# EasyEDA Pro project ProPrj_FOC_TEST_2025-02-24.epro, schematic 原理图

## Sheets
1 MUC: Create Date: 2024-08-19; Page Name: MUC; Project Name: FOC_TEST; Schematic Name: 原理图; Update Date: 2024-08-21; Company: 嘉立创EDA; Page Size: A4; Version: V1.0
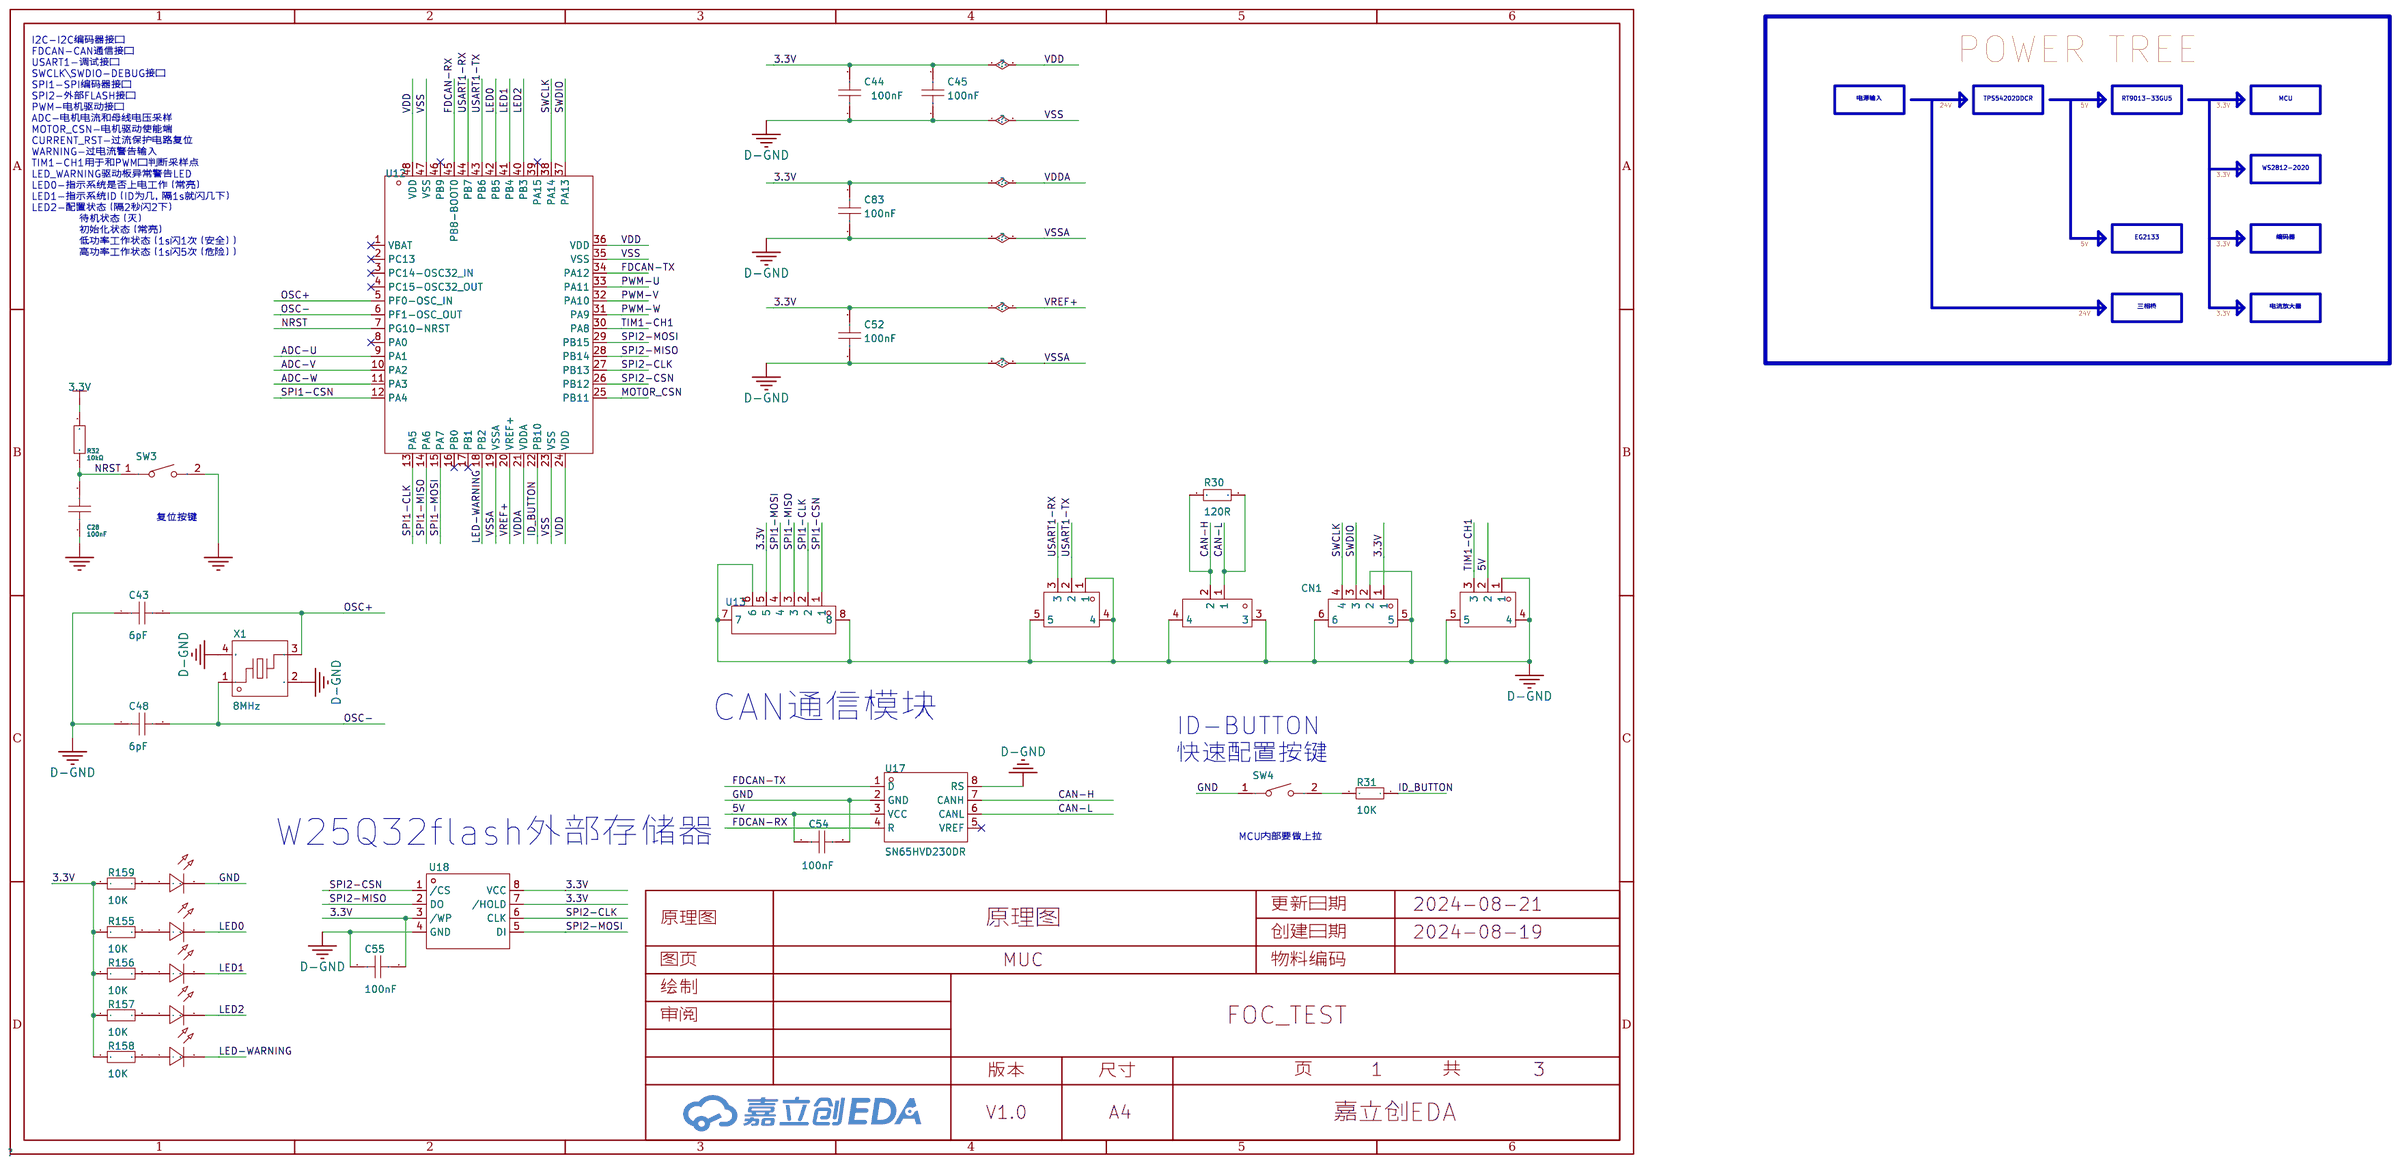
[diagram p0: MUC]
2 电源部分: Board Name: Board1; Page Name: 电源部分
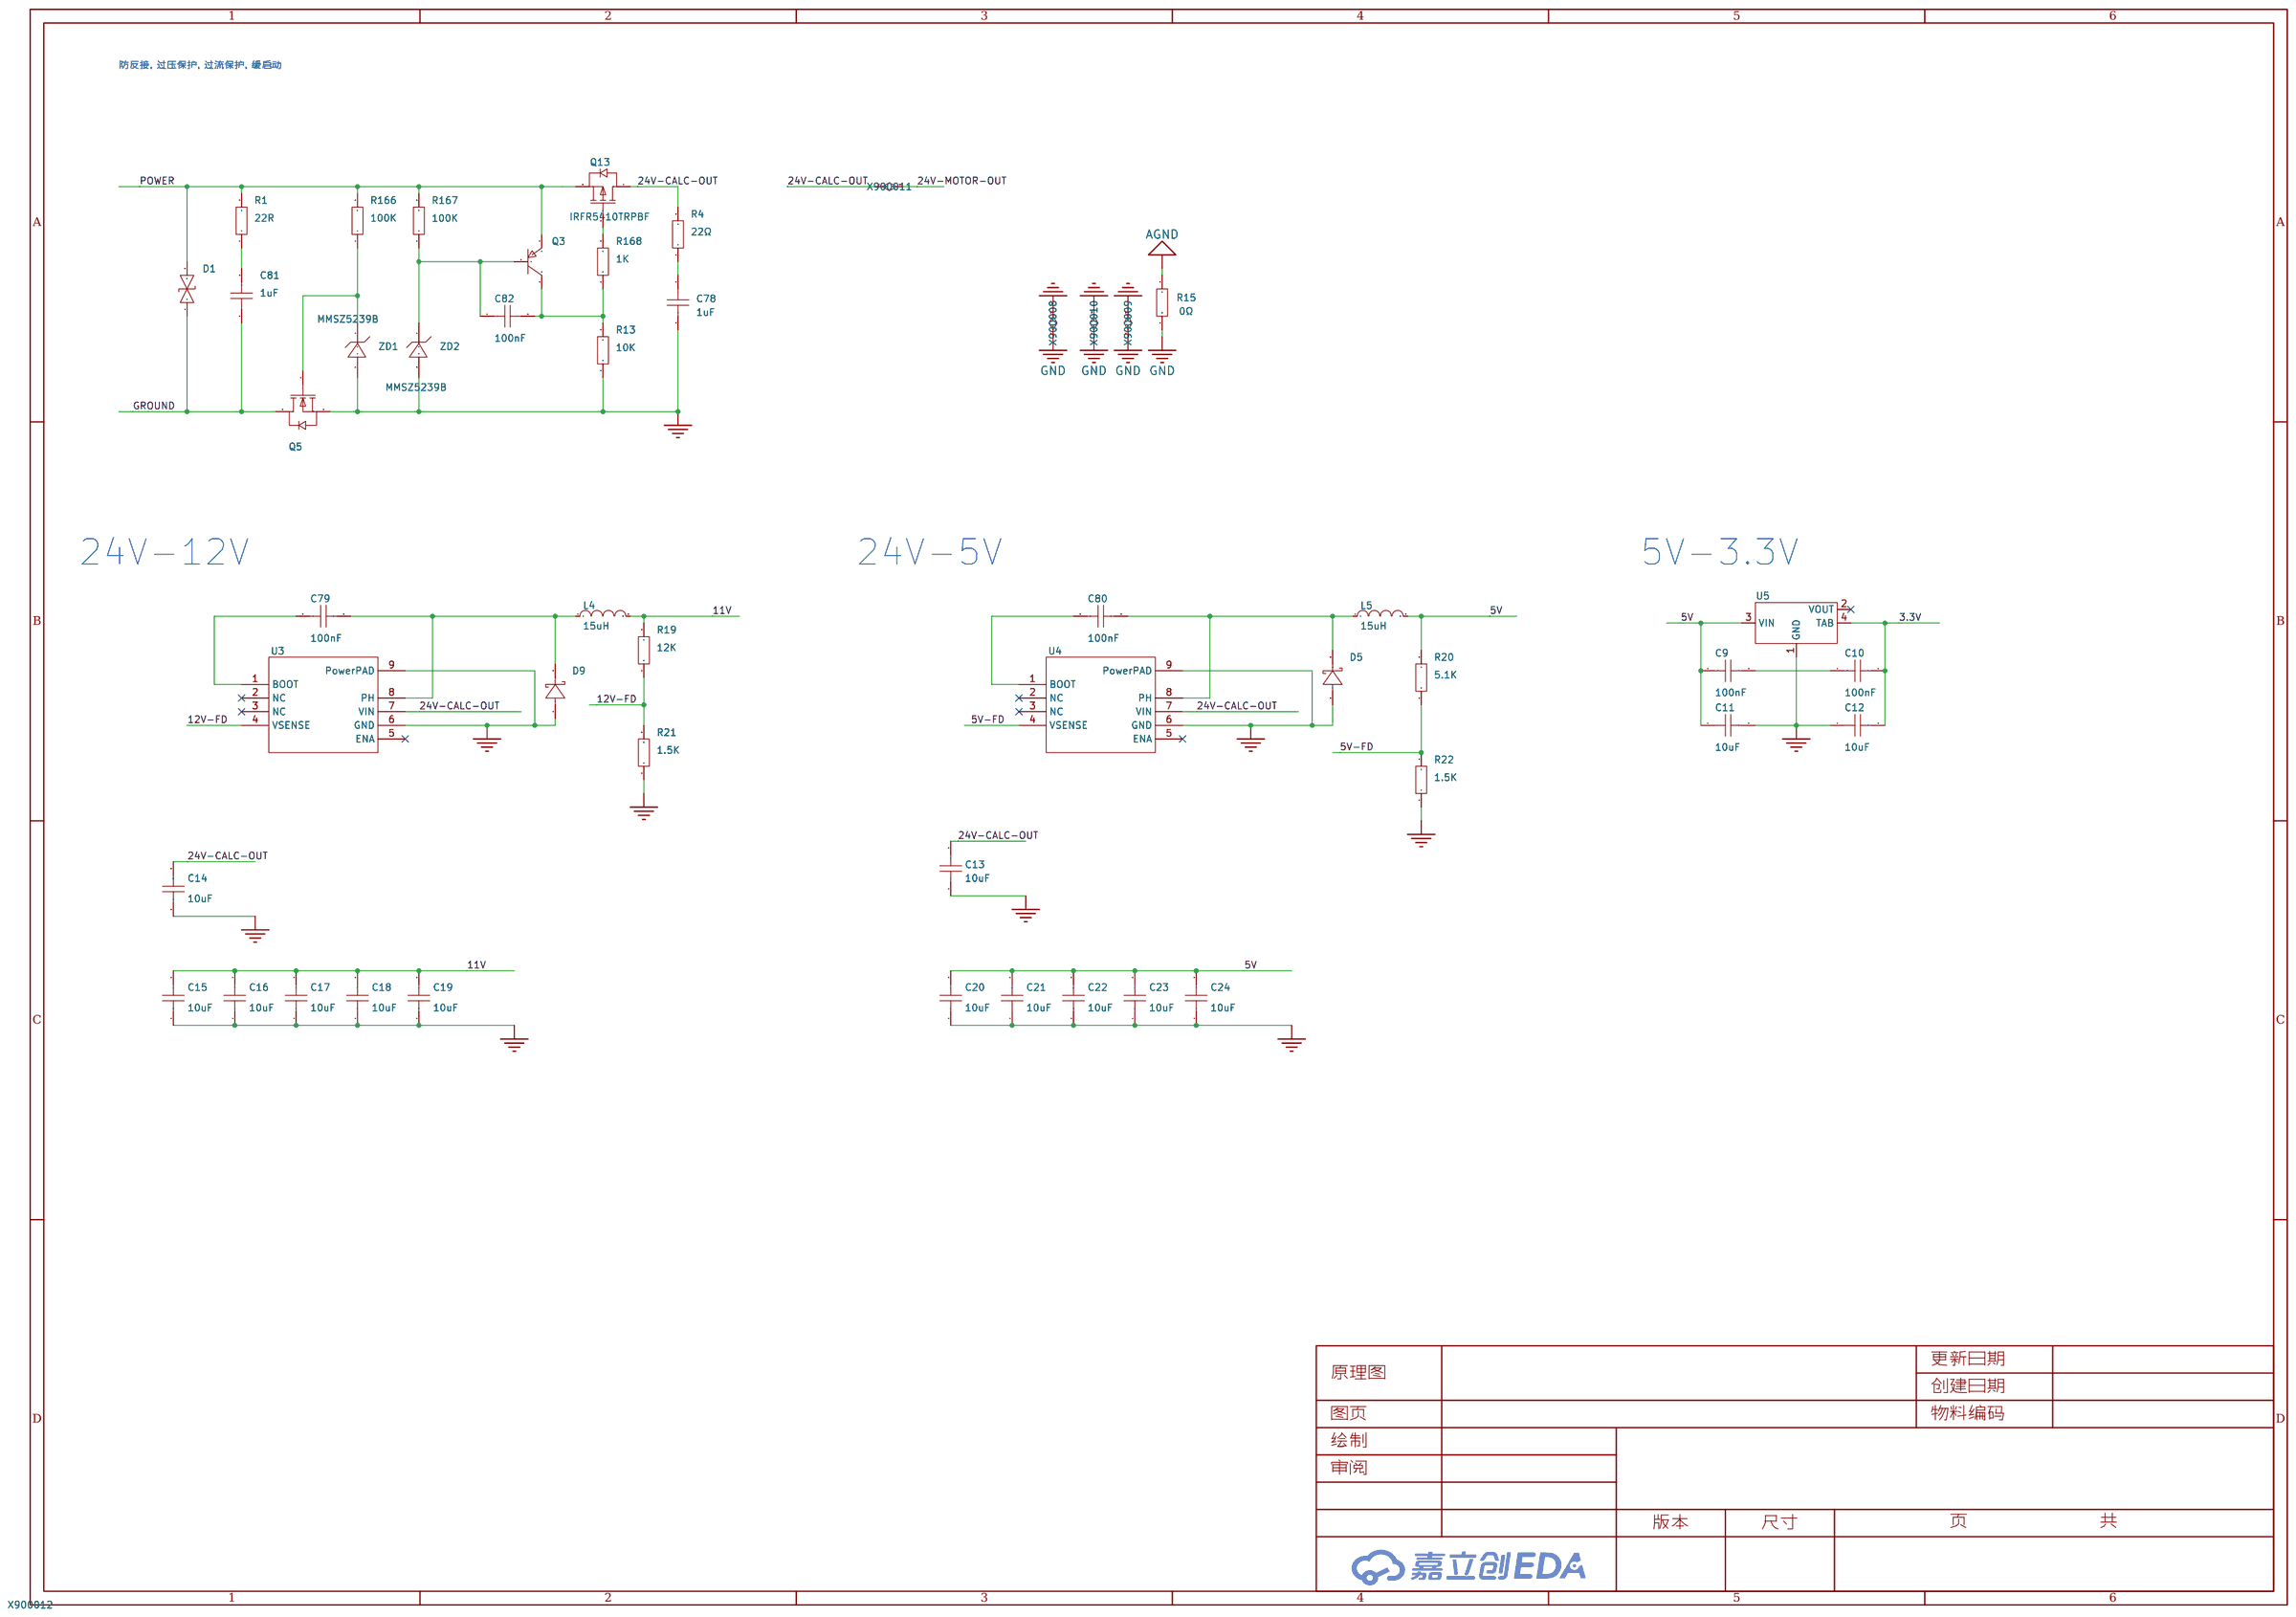
[diagram p1: 电源部分]
3 逆变桥采样: Create Date: 2024-08-20; Page Name: 逆变桥采样; Page Size: A3
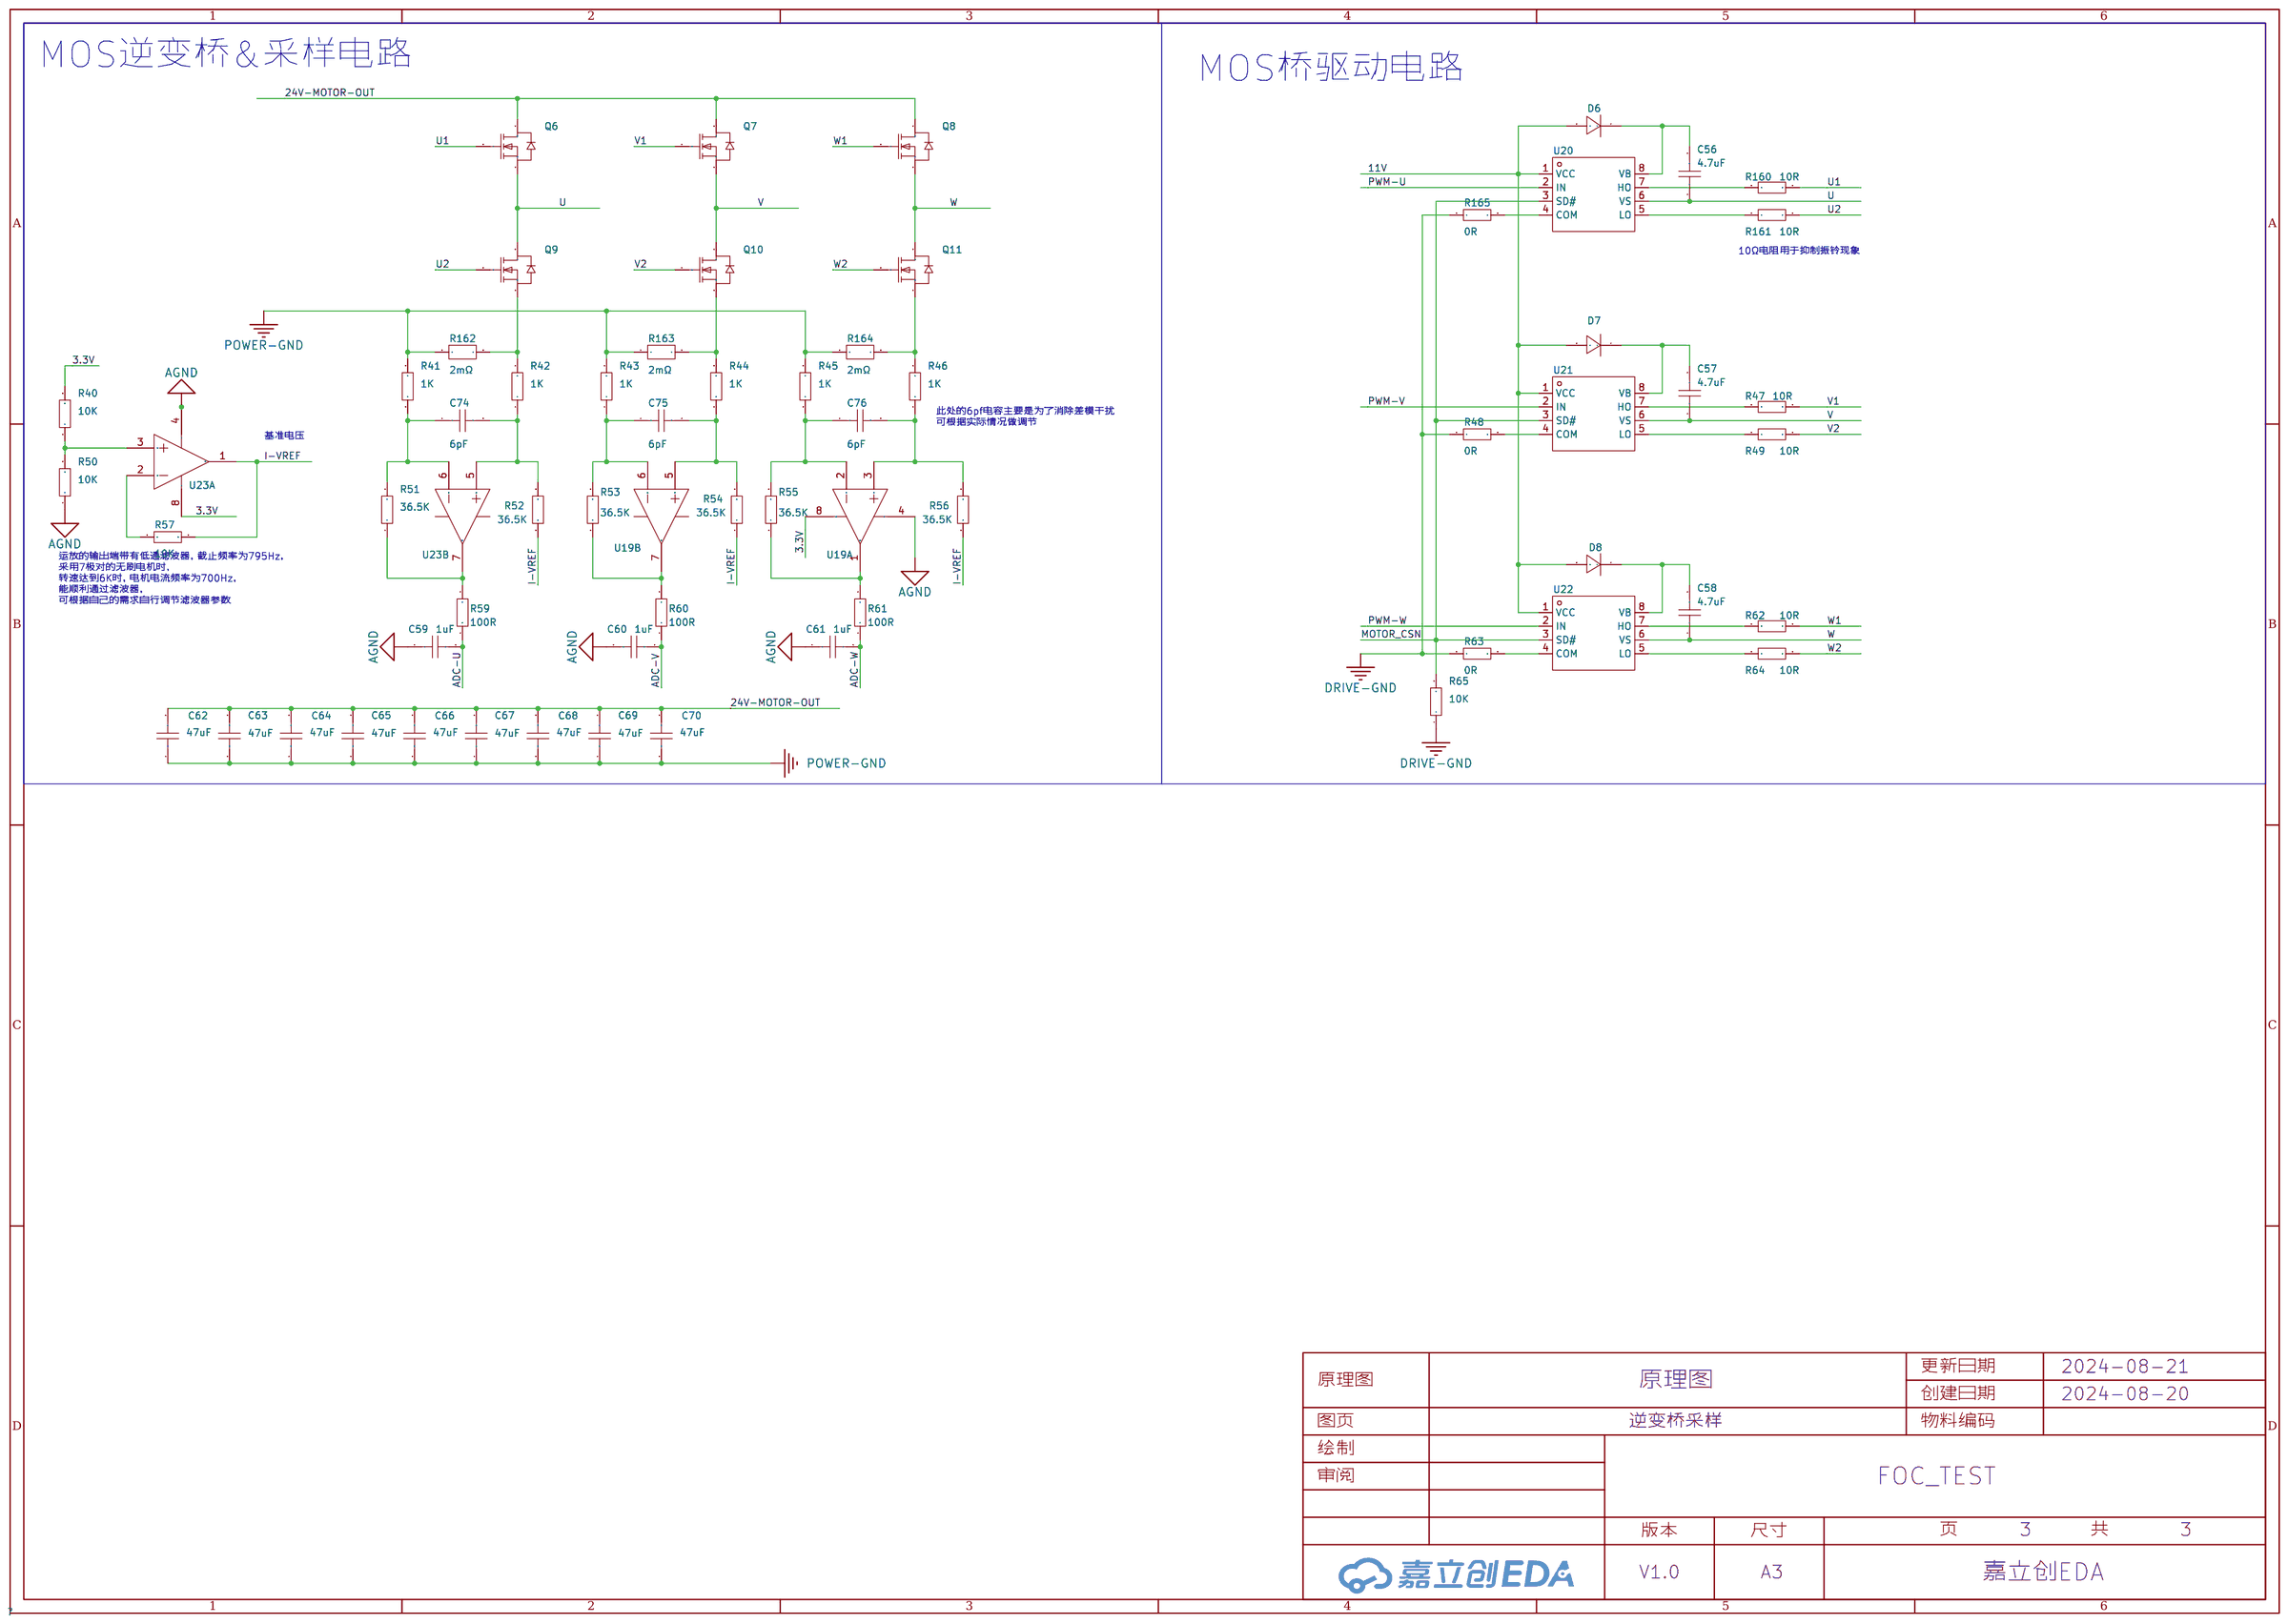
[diagram p2: 逆变桥采样]

## Parts
sheet MUC
C28  100nF  [C0603]
C43  6pF  [C0603]
C44  100nF  [C0603]
C45  100nF  [C0603]
C48  6pF  [C0603]
C52  100nF  [C0603]
C54  100nF  [C0603]
C55  100nF  [C0603]
C83  100nF  [C0603]
CN1  -  [CONN-SMD_1.25-4PWT]
LED1  -  [LED_0603]
LED2  -  [LED_0603]
LED3  -  [LED_0603]
LED4  -  [LED_0603]
LED5  -  [LED_0603]
R30  120R  [R0603]
R31  10K  [R0603]
R32  10kΩ  [r0603]
R155  10K  [R0603]
R156  10K  [R0603]
R157  10K  [R0603]
R158  10K  [R0603]
R159  10K  [R0603]
SW3  轻触按键3*4*H  [SW-SMD_L4.0-W2.9-LS5.0]
SW4  轻触按键3*4*H  [SW-SMD_L4.0-W2.9-LS5.0]
U12  -  [LQFP-48_L7.0-W7.0-P0.50-LS9.0-BL]
U13  -  [CONN-SMD_6P-P1.25_GH1.25-6PWBPZ]
U17  SN65HVD230DR  [SOIC-8_L4.9-W3.9-P1.27-LS6.0-BL]
U18  -  [SOIC-8_L5.2-W5.2-P1.27-LS7.9-BL]
U24  GH1.25-2P卧贴  [CONN-SMD_2P-P1.25_GH1.25-2PWBPZ]
U25  GH1.25-3P卧贴  [CONN-SMD_GH1.25-3P]
U26  GH1.25-3P卧贴  [CONN-SMD_GH1.25-3P]
X1  8MHz  [CRYSTAL-SMD_4P-L3.2-W2.5-BL]
sheet 电源部分
C9  100nF  [C0603]
C10  100nF  [C0603]
C11  10uF  [C0603]
C12  10uF  [C0603]
C13  10uF  [C1206]
C14  10uF  [C1206]
C15  10uF  [C0603]
C16  10uF  [C0603]
C17  10uF  [C0603]
C18  10uF  [C0603]
C19  10uF  [C0603]
C20  10uF  [C0603]
C21  10uF  [C0603]
C22  10uF  [C0603]
C23  10uF  [C0603]
C24  10uF  [C0603]
C78  1uF  [C0603]
C79  100nF  [C0603]
C80  100nF  [C0603]
C81  1uF  [C0603]
C82  100nF  [C0603]
D1  -  [SMB_L4.6-W3.6-LS5.3-BI]
D5  -  [SMA_L4.3-W2.5-LS5.0-FD]
D9  -  [SMA_L4.3-W2.5-LS5.0-FD]
L4  15uH  [IND-SMD_L4.0-W4.0_FNR40XXS]
L5  15uH  [IND-SMD_L4.0-W4.0_FNR40XXS]
Q3  -  [SOT-23-3_L2.9-W1.3-P1.90-LS2.4-BR]
Q5  -  [TO-252-2_L6.6-W6.1-P4.57-LS9.9-BR-CW]
Q13  IRFR5410TRPBF  [TO-252-2_L6.5-W6.1-P4.58-LS10.0-TR]
R1  22R  [R0603]
R4  22Ω  [R0603]
R13  10K  [R0603]
R15  0Ω  [R0805]
R19  12K  [R0603]
R20  5.1K  [R0603]
R21  1.5K  [R0603]
R22  1.5K  [R0603]
R166  100K  [R0603]
R167  100K  [R0603]
R168  1K  [R0603]
U3  -  [SOIC-8_L5.0-W4.0-P1.27-LS6.0-BL-EP2.0]
U4  -  [SOIC-8_L5.0-W4.0-P1.27-LS6.0-BL-EP2.0]
U5  -  [SOT-223-4_L6.5-W3.5-P2.30-LS7.0-BR]
ZD1  MMSZ5239B  [SOD-123_L2.8-W1.8-LS3.7-RD]
ZD2  MMSZ5239B  [SOD-123_L2.8-W1.8-LS3.7-RD]
sheet 逆变桥采样
C56  4.7uF  [C0603]
C57  4.7uF  [C0603]
C58  4.7uF  [C0603]
C59  1uF  [C0603]
C60  1uF  [C0603]
C61  1uF  [C0603]
C62  47uF  [C1206]
C63  47uF  [C1206]
C64  47uF  [C1206]
C65  47uF  [C1206]
C66  47uF  [C1206]
C67  47uF  [C1206]
C68  47uF  [C1206]
C69  47uF  [C1206]
C70  47uF  [C1206]
C74  6pF  [C0603]
C75  6pF  [C0603]
C76  6pF  [C0603]
D6  -  [DO-214AC_L4.3-W2.7-LS5.3-RD]
D7  -  [DO-214AC_L4.3-W2.7-LS5.3-RD]
D8  -  [DO-214AC_L4.3-W2.7-LS5.3-RD]
Q6  -  [TO-252-2_L6.6-W6.1-P4.57-LS9.9-BR-CW]
Q7  -  [TO-252-2_L6.6-W6.1-P4.57-LS9.9-BR-CW]
Q8  -  [TO-252-2_L6.6-W6.1-P4.57-LS9.9-BR-CW]
Q9  -  [TO-252-2_L6.6-W6.1-P4.57-LS9.9-BR-CW]
Q10  -  [TO-252-2_L6.6-W6.1-P4.57-LS9.9-BR-CW]
Q11  -  [TO-252-2_L6.6-W6.1-P4.57-LS9.9-BR-CW]
R40  10K  [R0603]
R41  1K  [R0603]
R42  1K  [R0603]
R43  1K  [R0603]
R44  1K  [R0603]
R45  1K  [R0603]
R46  1K  [R0603]
R47  10R  [R0603]
R48  0R  [R0603]
R49  10R  [R0603]
R50  10K  [R0603]
R51  36.5K  [R0603]
R52  36.5K  [R0603]
R53  36.5K  [R0603]
R54  36.5K  [R0603]
R55  36.5K  [R0603]
R56  36.5K  [R0603]
R57  10K  [R0603]
R59  100R  [R0603]
R60  100R  [R0603]
R61  100R  [R0603]
R62  10R  [R0603]
R63  0R  [R0603]
R64  10R  [R0603]
R65  10K  [R0603]
R160  10R  [R0603]
R161  10R  [R0603]
R162  2mΩ  [RES-SMD_L6.4-W3.2-A]
R163  2mΩ  [RES-SMD_L6.4-W3.2-A]
R164  2mΩ  [RES-SMD_L6.4-W3.2-A]
R165  0R  [R0603]
U19  -  [SOIC-8_L4.9-W3.9-P1.27-LS6.0-BL]  (sections 1,2)
U20  -  [SOIC-8_L4.9-W3.9-P1.27-LS6.0-BL]
U21  -  [SOIC-8_L4.9-W3.9-P1.27-LS6.0-BL]
U22  -  [SOIC-8_L4.9-W3.9-P1.27-LS6.0-BL]
U23  -  [SOIC-8_L4.9-W3.9-P1.27-LS6.0-BL]  (sections 1,2)

## Library data of the parts
C28 = CL05B104KB54PNC: 容值:100nF;精度:±10%;额定电压:50V;材质(温度系数):X7R;; LCSC Part Name: 100nF ±10% 50V; Supplier Part: C307331; Manufacturer: SAMSUNG(三星); Supplier Footprint: 0402; JLCPCB Part Class: 基础库; Datasheet: https://atta.szlcsc.com/upload/public/pdf/source/20160218/1457707763339.pdf; Supplier: LCSC; Tolerance: ±10%; Voltage Rated: 50V; Temperature Coefficient: X7R
C9-C12 C15-C24 C43-C45 C48 C52 C54-C61 C74-C76 C79-C83 = CAP_0603: 容值:100nF;精度:±10%;额定电压:50V;温度系数:X7R;; Supplier Footprint: 0603
CN1 = 1.25-4PWT: 系列:-;连接器类型:-;触头类型:-;间距:-;针脚数:-;; LCSC Part Name: 4P 1.25mm; Supplier Part: C2763632; Supplier Footprint: SMD; JLCPCB Part Class: Extended Part; Datasheet: https://atta.szlcsc.com/upload/public/pdf/source/20210407/C2763630_1F55A4CF96FF27F08DE8CC60DA29871C.pdf; Supplier: LCSC
LED1 LED4 LED5 = LED_0603-R: Supplier Footprint: 0603
LED2 = LED_0603-G: Supplier Footprint: 0603
LED3 = LED_0603-B: Supplier Footprint: 0603
R1 R13 R19-R22 R30 R31 R40-R57 R59-R65 R155-R161 R165-R168 = Res_0603: Supplier Footprint: 0603
R32 = 0402WGF1002TCE: 电阻类型:厚膜电阻;阻值:10kΩ;精度:±1%;功率:62.5mW;最大工作电压:50V;温度系数:±100ppm/℃;; LCSC Part Name: 10kΩ ±1% 62.5mW 厚膜电阻; Supplier Part: C25744; Manufacturer: UNI-ROYAL(厚声); Supplier Footprint: 0402; JLCPCB Part Class: 基础库; Datasheet: https://atta.szlcsc.com/upload/public/pdf/source/20200306/C422600_1E6D84923E4A46A82E41ADD87F860B5C.pdf; Supplier: LCSC; Type: 厚膜电阻; Tolerance: ±1%; Power(Watts): 62.5mW; Overload Voltage (Max): 50V; Temperature Coefficient: ±100ppm/℃; Operating Temperature Range: -55℃~+155℃
SW3 SW4 = 轻触按键3*4*H: Supplier Part: C9900017573; Supplier Footprint: 轻触按键3*4*2.5; JLCPCB Part Class: 扩展库; Datasheet: https://atta.szlcsc.comnull; Supplier: LCSC
U12 = STM32G431CBT6: Supplier Part: C529355; Manufacturer: ST(意法半导体); Supplier Footprint: LQFP-48; JLCPCB Part Class: Extended Part; Datasheet: https://atta.szlcsc.com/upload/public/pdf/source/20200511/C529354_7C66CF00837B904D0C15DCE45B69418C.pdf; Supplier: LCSC
U13 = GH1.25-6PWBPZ: LCSC Part Name: GH1.25-6P卧贴编带; Supplier Part: C2829255; Manufacturer: BOOMELE(博穆精密); JLCPCB Part Class: Extended Part; Datasheet: https://atta.szlcsc.com/upload/public/pdf/source/20211125/08A09A4909F58AF780B71FE423A00F7E.pdf; Supplier: LCSC
U17 = SN65HVD230DR: 类型:收发器;数据速率:1Mbps;; LCSC Part Name: 1Mbps 3V~3.6V; Supplier Part: C12084; Manufacturer: TI(德州仪器); Supplier Footprint: SOIC-8; JLCPCB Part Class: 扩展库; Datasheet: https://www.ti.com/cn/lit/gpn/sn65hvd230; Supplier: LCSC; Type: 收发器; Data Rate: 1Mbps; Supply Voltage: 3V~3.6V; Operating Temperature: -40℃~+85℃
U18 = W25Q32JVSSIQ: 存储器类型:-;存储器构架(格式):-;技术:-;存储器容量:-;时钟频率:-;存储器接口类型:-;; Supplier Part: C2834491; Manufacturer: WINBOND(华邦); Supplier Footprint: SOIC-8; JLCPCB Part Class: Extended Part; Datasheet: https://atta.szlcsc.com/upload/public/pdf/source/20200623/C571260_35A2CBF0DA721D829503B2D99A541AE2.pdf; Supplier: LCSC
U24 = GH1.25-2P卧贴: Supplier Part: C9900014668; JLCPCB Part Class: 扩展库; Supplier: LCSC
U25 U26 = GH1.25-3P卧贴: Supplier Part: C9900014671; JLCPCB Part Class: 扩展库; Supplier: LCSC
X1 = X32258MSB4SI: 晶振类型:贴片无源晶振;频率:8MHz;频率公差:±10ppm;频率稳定度:±30ppm;负载电容:20pF;工作温度:-40~+85;; LCSC Part Name: 20pF ±10ppm 8MHz; Supplier Part: C2682774; Manufacturer: YXC扬兴科技; Supplier Footprint: SMD3225-4P; JLCPCB Part Class: Extended Part; Datasheet: https://atta.szlcsc.com/upload/public/pdf/source/20210106/C2682774_0CD4FDA5D9DA3FBEEC23BD607A48E4B0.pdf; Supplier: LCSC; Crystal Type: 贴片无源晶振; Frequency Tolerance: ±10ppm; Frequency Stability: ±30ppm; Load Capacitance: 20pF; Operating Temperature: -40~+85
C13 C14 C62-C70 = CAP_1206: 容值:100nF;精度:±10%;额定电压:50V;温度系数:X7R;; Supplier Footprint: 1206
C78 = CL10A105KB8NNNC: 容值:1uF;精度:±10%;额定电压:50V;材质(温度系数):X5R;; LCSC Part Name: 1uF ±10% 50V; Supplier Part: C15849; Manufacturer: SAMSUNG(三星); Supplier Footprint: 0603; JLCPCB Part Class: Basic Part; Datasheet: https://atta.szlcsc.com/upload/public/pdf/source/20160103/1457707679084.pdf; Supplier: LCSC; Tolerance: ±10%; Voltage Rated: 50V; Temperature Coefficient: X5R
D1 = SMBJ36CA-C114002: Pin Type: IN
D5 D9 = SS34: 二极管配置:独立式;直流反向耐压(Vr):40V;平均整流电流(Io):3A;正向压降(Vf):550mV@3A;反向电流(Ir):500A@40V;; LCSC Part Name: 40V 3A 550mV@3A; Supplier Part: C2931787; Manufacturer: Doeshare(德芯); Supplier Footprint: SMA; JLCPCB Part Class: Extended Part; Datasheet: https://atta.szlcsc.com/upload/public/pdf/source/20220105/EDEF617DBB50E389FEB58D03748E8B49.pdf; Supplier: LCSC; Diode Configuration: 独立式; Reverse Voltage (Vr): 40V; Average Rectified Current (Io): 3A; Forward Voltage (Vf@If): 550mV@3A; Reverse Leakage Current (Ir): 500A@40V
L4 L5 = FNR4030S470MT: 电感值:47uH;精度:±20%;额定电流:800mA;饱和电流(Isat):1A;; LCSC Part Name: 47uH ±20% 1A; Supplier Part: C167888; Manufacturer: cjiang(长江微电); Supplier Footprint: SMD,4x4mm; JLCPCB Part Class: 扩展库; Datasheet: https://atta.szlcsc.com/upload/public/pdf/source/20190327/C167925_9EFF0AABC4CA629C2CC95961DBF7D39D.pdf; Supplier: LCSC; Tolerance: ±20%; Rated Current: 800mA; Saturation Current (Isat): 1A; DC Resistance (DCR): 579mΩ
Q3 = PMBT3906,215: Pin Type: IN
Q5 = IRLR8726TRPBF: Pin Type: IN
Q13 = IRFR5410TRPBF: 类型:P沟道;漏源电压(Vdss):100V;连续漏极电流(Id):13A;功率(Pd):66W;导通电阻(RDS(on)@Vgs,Id):205mΩ@10V,7.8A;阈值电压(Vgs(th)@Id):4V@250uA;; LCSC Part Name: P沟道 耐压:100V 电流:13A; Supplier Part: C3018; Manufacturer: Infineon(英飞凌); Supplier Footprint: TO-252-2(DPAK); JLCPCB Part Class: 扩展库; Datasheet: https://atta.szlcsc.com/upload/public/pdf/source/20200525/C537986_D000D7687454765D53273407B6117675.pdf; Supplier: LCSC; Type: P沟道; Drain Source Voltage (Vdss): 100V; Continuous Drain Current (Id): 13A; Power Dissipation (Pd): 66W; Drain Source On Resistance (RDS(on)@Vgs,Id): 205mΩ@10V,7.8A; Gate Threshold Voltage (Vgs(th)@Id): 4V@250uA; Total Gate Charge (Qg@Vgs): 58nC@10V; Input Capacitance (Ciss@Vds): 760pF@25V; Operating Temperature: -55℃~+150℃@(Tj)
R4 = 0603WAF220JT5E: 电阻类型:厚膜电阻;阻值:22Ω;精度:±1%;功率:100mW;; LCSC Part Name: 22Ω ±1% 100mW; Supplier Part: C23345; Manufacturer: UNI-ROYAL(厚声); Supplier Footprint: 0603; JLCPCB Part Class: Basic Part; Datasheet: https://atta.szlcsc.com/upload/public/pdf/source/20200306/C422600_1E6D84923E4A46A82E41ADD87F860B5C.pdf; Supplier: LCSC; Type: 厚膜电阻; Tolerance: ±1%; Power(Watts): 100mW; Temperature Coefficient: ±100ppm/℃; Overload Voltage (Max): 75V; Operating Temperature Range: -55℃~+155℃
R15 = Res_0805: Supplier Part: C319941; Supplier Footprint: 0805
U3 U4 = TPS5430DDAR: 功能类型:降压型;同步整流:-;输出通道数:-;拓扑结构:-;输入电压:-;输出电流(最大值):-;开关频率:-;; LCSC Part Name: 降压型; Supplier Part: C9864; Manufacturer: TI(德州仪器); Supplier Footprint: SO-8; JLCPCB Part Class: Basic Part; Datasheet: https://atta.szlcsc.com/upload/public/pdf/source/20161207/1481104217724.pdf; Supplier: LCSC; Function: 降压型
U5 = AMS1117-3.3V: 输出类型:固定;输出极性:正;输出通道数:1;最大输入电压:18V;输出电压:3.3V;压差:1.3V@(1A);输出电流:1A;电源纹波抑制比(PRSS):60dB@(120Hz);; LCSC Part Name: SK12D07VG3; Supplier Part: C347222; Manufacturer Part: SK12D07VG3; Supplier Footprint: SOT-223; JLCPCB Part Class: Extended Part; Datasheet: https://atta.szlcsc.com/upload/public/pdf/source/20160702/1467448296695.pdf; Supplier: LCSC
ZD1 ZD2 = MMSZ5239B: 二极管配置:独立式;稳压值(标称值):9.1V;稳压值(范围):8.65V~9.56V;精度:-;功率:350mW;反向电流(Ir):3uA@7V;阻抗(Zzt):10Ω;; LCSC Part Name: 9.1V 350mW 9V1 F4; Supplier Part: C21546; Manufacturer: CJ(江苏长电/长晶); Supplier Footprint: SOD-123; JLCPCB Part Class: Extended Part; Datasheet: https://atta.szlcsc.com/upload/public/pdf/source/20140301/1457707001773.pdf; Supplier: LCSC; Diode Configuration: 独立式; Zener Voltage (Nom): 9.1V; Zener Voltage (Range): 8.65V~9.56V; Power Dissipation: 350mW; Reverse Leakage Current (Ir): 3uA@7V; Zener Impedance (Zzt): 10Ω
D6-D8 = US1J: 二极管配置:-;直流反向耐压(Vr):600V;平均整流电流(Io):1A;正向压降(Vf):1.7V@1A;反向电流(Ir):5A@600V;反向恢复时间(trr):75ns;工作温度:-65~+150@(Tj);; LCSC Part Name: 600V 1A 75ns; Supplier Part: C84070; Manufacturer: 星海; Supplier Footprint: SMA; JLCPCB Part Class: Extended Part; Datasheet: https://atta.szlcsc.com/upload/public/pdf/source/20161024/1477288599591.pdf; Supplier: LCSC; Reverse Voltage (Vr): 600V; Average Rectified Current (Io): 1A; Forward Voltage (Vf@If): 1.7V@1A; Reverse Leakage Current: 5A@600V; Reverse Recovery Time (trr): 75ns; Operating Temperature: -65~+150@(Tj)
Q6-Q11 = IRLR8726TRPBF: 类型:N沟道;漏源电压(Vdss):30V;连续漏极电流(Id):86A;功率(Pd):75W;导通电阻(RDS(on)@Vgs,Id):5.8mΩ@10V,25A;阈值电压(Vgs(th)@Id):2.35V@50A;; LCSC Part Name: N沟道 30V 86A; Supplier Part: C81137; Manufacturer: Infineon(英飞凌); Supplier Footprint: TO-252-2(DPAK); JLCPCB Part Class: Extended Part; Datasheet: https://atta.szlcsc.com/upload/public/pdf/source/20171026/C81137_15089842732451059266.pdf; Supplier: LCSC; Type: N沟道; Drain Source Voltage (Vdss): 30V; Continuous Drain Current (Id): 86A; Power Dissipation (Pd): 75W; Drain Source On Resistance (RDS(on)@Vgs,Id): 5.8mΩ@10V,25A; Gate Threshold Voltage (Vgs(th)@Id): 2.35V@50A
R162-R164 = HoLR2512-2mR-1%: 电阻类型:-;阻值:2mΩ;精度:±1%;功率:-;温度系数:-;最大工作电压:-;工作温度范围:-50~+170;; LCSC Part Name: 2mΩ ±1%; Supplier Part: C2844506; Manufacturer: Milliohm(毫欧); Supplier Footprint: 2512; JLCPCB Part Class: Extended Part; Datasheet: https://atta.szlcsc.com/upload/public/pdf/source/20210709/C2844506_4CCB637F1FEE9ADA5297A500D860BFF4.pdf; Supplier: LCSC; Tolerance: ±1%; Operating Temperature Range: -50~+170
U19 U23 = SGM722XS/TR: 运放类型:CMOS;放大器组数:2;增益带宽积（GBP）:11MHz;压摆率（SR）:8.5 V/us;电源电压:2.1V ~ 5.5V;各通道供电电流:1.75mA;; Supplier Part: C191966; Manufacturer: SGMICRO(圣邦微); Supplier Footprint: SOIC-8_150mil; JLCPCB Part Class: Extended Part; Datasheet: https://atta.szlcsc.com/upload/public/pdf/source/20180528/C191966_1DD9F64129C861E1FD08369D3FBA3976.pdf; Supplier: LCSC; Amplifier Type: CMOS; Number of Circuits: 2; Gain Bandwidth Product（GBP）: 11MHz; Slew Rate（SR）: 8.5 V/us; Output Type: Rail-to-Rail; Supply Voltage（Single）: 2.1V ~ 5.5V; Iq per channel (Typ): 1.75mA; Operating Temperature: -40°C ~ 125°C
U20-U22 = IR2104STRPBF: 600V，半桥式驱动器，门驱动供应电压范围：10V to 20V; Supplier Part: C2960; Manufacturer: Infineon(英飞凌); Supplier Footprint: SOIC-8_150mil; JLCPCB Part Class: Extended Part; Datasheet: https://atta.szlcsc.com/upload/public/pdf/source/20140906/1457707236579.pdf; Supplier: LCSC

## Nets
3.3V: C10.2 C12.2 C44.2 C45.2 C52.2 C55.2 C83.2 CN1.1 R32.2 R40.2 R155.1 R156.1 R157.1 R158.1 R159.1 U5.4(TAB) U12.20(VREF+) U12.21(VDDA) U12.24(VDD) U12.36(VDD) U12.48(VDD) U13.5 U18.3(/WP) U18.7(/HOLD) U18.8(VCC) U19.8(+VS) U23.8(+VS)
5V: C9.1 C11.1 C20.2 C21.2 C22.2 C23.2 C24.2 C54.1 L5.2 R20.2 U5.3(VIN) U17.3(VCC) U26.2
5V-FD: R20.1 R22.2 U4.4(VSENSE)
11V: C15.2 C16.2 C17.2 C18.2 C19.2 D6.2(A) D7.2(A) D8.2(A) L4.2 R19.2 U20.1(VCC) U21.1(VCC) U22.1(VCC)
12V-FD: R19.1 R21.2 U3.4(VSENSE)
24V-CALC-OUT: C13.2 C14.2 C62.2 C63.2 C64.2 C65.2 C66.2 C67.2 C68.2 C69.2 C70.2 Q6.2(D) Q7.2(D) Q8.2(D) Q13.4(D) R4.2 U3.7(VIN) U4.7(VIN)
AGND: C59.1 C60.1 C61.1 R15.2 R50.1 U19.4(-VS) U23.4(-VS)
V1: Q7.1(G) R47.2
V2: Q10.1(G) R49.2
ADC-U: C59.2 R59.1 U12.9(PA1)
ADC-V: C60.2 R60.1 U12.10(PA2)
ADC-W: C61.2 R61.1 U12.11(PA3)
CAN-H: R30.1 U17.7(CANH) U24.2
CAN-L: R30.2 U17.6(CANL) U24.1
D-GND: C9.2 C10.1 C11.2 C12.1 C13.1 C14.1 C15.1 C16.1 C17.1 C18.1 C19.1 C20.1 C21.1 C22.1 C23.1 C24.1 C28.1 C43.1 C44.1 C45.1 C48.1 C52.1 C54.2 C55.1 C62.1 C63.1 C64.1 C65.1 C66.1 C67.1 C68.1 C69.1 C70.1 C78.2 C83.1 CN1.2 CN1.5 CN1.6 D5.1(A) D9.1(A) LED5.1(C) Q5.3(S) R13.1 R15.1 R21.1 R22.1 R41.2 R43.2 R45.2 R48.1 R63.1 R65.1 R162.1 R163.1 R164.1 R165.1 SW3.2 SW4.1 U3.6(GND) U3.9(PowerPAD) U4.6(GND) U4.9(PowerPAD) U5.1(GND) U12.19(VSSA) U12.23(VSS) U12.35(VSS) U12.47(VSS) U13.6 U13.7 U13.8 U17.2(GND) U17.8(RS) U18.4(GND) U24.3 U24.4 U25.1 U25.4 U25.5 U26.1 U26.4 U26.5 X1.2(GND) X1.4(GND) ZD1.2(A) ZD2.2(A)
FDCAN-RX: U12.45(PB8-BOOT0) U17.4(R)
FDCAN-TX: U12.34(PA12) U17.1(D)
GROUND: C81.1 D1.1 Q5.2(D)
I-VREF: R52.1 R54.1 R56.1 R57.2 U23.1(OUTA)
ID_BUTTON: R31.1 U12.22(PB10)
LED0: LED1.1(C) U12.42(PB5)
LED1: LED2.1(C) U12.41(PB4)
LED2: LED3.1(C) U12.40(PB3)
LED-WARNING: LED4.1(C) U12.18(PB2)
MOTOR_CSN: R65.2 U12.25(PB11) U20.3(SD#) U21.3(SD#) U22.3(SD#)
NRST: C28.2 R32.1 SW3.1 U12.7(PG10-NRST)
OSC+: C43.2 U12.5(PF0-OSC_IN) X1.3
OSC-: C48.2 U12.6(PF1-OSC_OUT) X1.1
POWER: D1.2 Q3.2 Q13.3(S) R1.2 R166.2 R167.2
PWM-U: U12.33(PA11) U20.2(IN)
PWM-V: U12.32(PA10) U21.2(IN)
PWM-W: U12.31(PA9) U22.2(IN)
SPI1-CLK: U12.13(PA5) U13.2
SPI1-CSN: U12.12(PA4) U13.1
SPI1-MISO: U12.14(PA6) U13.3
SPI1-MOSI: U12.15(PA7) U13.4
SPI2-CLK: U12.27(PB13) U18.6(CLK)
SPI2-CSN: U12.26(PB12) U18.1(/CS)
SPI2-MISO: U12.28(PB14) U18.2(DO)
SPI2-MOSI: U12.29(PB15) U18.5(DI)
SWCLK: CN1.4 U12.38(PA14)
SWDIO: CN1.3 U12.37(PA13)
TIM1-CH1: U12.30(PA8) U26.3
U: C56.1 Q6.3(S) Q9.2(D) U20.6(VS)
U1: Q6.1(G) R160.2
U2: Q9.1(G) R161.2
USART1-RX: U12.44(PB7) U25.3
USART1-TX: U12.43(PB6) U25.2
V: C57.1 Q7.3(S) Q10.2(D) U21.6(VS)
W: C58.1 Q8.3(S) Q11.2(D) U22.6(VS)
W1: Q8.1(G) R62.2
W2: Q11.1(G) R64.2
$1N6953: LED1.2(A) R155.2
$1N6979: LED2.2(A) R156.2
$1N7005: LED3.2(A) R157.2
$1N7093: LED4.2(A) R158.2
$1N7148: LED5.2(A) R159.2
$1N7337: R31.2 SW4.2
$2N12458: C78.1 R4.1
$2N13942: C80.1 U4.1(BOOT)
$2N13955: C79.1 U3.1(BOOT)
$2N15647: C81.2 R1.1
$2N15648: Q5.1(G) R166.1 ZD1.1(K)
$2N15651: C82.2 Q3.3 R13.2 R168.1
$2N15656: Q13.1(G) R168.2
$2N15879: C82.1 Q3.1 R167.1 ZD2.1(K)
$3N2085: Q9.3(S) R42.2 R162.2
$3N2087: Q11.3(S) R46.2 R164.2
$3N2102: R160.1 U20.7(HO)
$3N2107: R161.1 U20.5(LO)
$3N2110: R47.1 U21.7(HO)
$3N2115: R49.1 U21.5(LO)
$3N2118: R62.1 U22.7(HO)
$3N2123: R64.1 U22.5(LO)
$3N2134: C58.2 D8.1(K) U22.8(VB)
$3N2135: C57.2 D7.1(K) U21.8(VB)
$3N2136: C56.2 D6.1(K) U20.8(VB)
$3N2146: Q10.3(S) R44.2 R163.2
$3N2147: C75.2 R44.1 R54.2 U19.5(INB+)
$3N2148: C76.2 R46.1 R56.2 U19.3(INA+)
$3N2149: C74.2 R42.1 R52.2 U23.5(INB+)
$3N2152: C74.1 R41.1 R51.2 U23.6(INB-)
$3N2153: C75.1 R43.1 R53.2 U19.6(INB-)
$3N2154: C76.1 R45.1 R55.2 U19.2(INA-)
$3N2156: R165.2 U20.4(COM)
$3N2159: R48.2 U21.4(COM)
$3N2161: R63.2 U22.4(COM)
$3N2163: R57.1 U23.2(INA-)
$3N2166: R40.1 R50.2 U23.3(INA+)
$3N2167: R51.1 R59.2 U23.7(OUTB)
$3N2168: R53.1 R60.2 U19.7(OUTB)
$3N2169: R55.1 R61.2 U19.1(OUTA)
Net-(C79-2): C79.2 D9.2(K) L4.1 U3.8(PH)
Net-(C80-2): C80.2 D5.2(K) L5.1 U4.8(PH)

Not connected (* = marked no-connect by the designer): U3 2(NC)* 3(NC)* 5(ENA)*; U4 2(NC)* 3(NC)* 5(ENA)*; U5 2(VOUT)*; U12 1(VBAT)* 2(PC13)* 3(PC14-OSC32_IN)* 4(PC15-OSC32_OUT)* 8(PA0)* 16(PB0)* 17(PB1)* 39(PA15)* 46(PB9)*; U17 5(VREF)*

## Notes on the sheets
sheet 1
- I2C-I2C编码器接口
  FDCAN-CAN通信接口
  USART1-调试接口
  SWCLK\SWDIO-DEBUG接口
  SPI1-SPI编码器接口
  SPI2-外部FLASH接口
  PWM-电机驱动接口
  ADC-电机电流和母线电压采样
  MOTOR_CSN-电机驱动使能端
  CURRENT_RST-过流保护电路复位
  WARNING-过电流警告输入
  TIM1-CH1用于和PWM口判断采样点
  LED_WARNING驱动板异常警告LED
  LED0-指示系统是否上电工作（常亮）
  LED1-指示系统ID（ID为几，隔1s就闪几下）
  LED2-配置状态（隔2秒闪2下）
           待机状态（灭）
           初始化状态（常亮）
           低功率工作状态（1s闪1次（安全））
           高功率工作状态（1s闪5次（危险））
- POWER TREE
- 电源输入
- 24V
- TPS54202DDCR
- 5V
- RT9013-33GU5
- 3.3V
- MCU
- 3.3V
- WS2812-2020
- 5V
- EG2133
- 3.3V
- 编码器
- 三相桥
- 电流放大器
- 24V
- 3.3V
- 复位按键
- ID-BUTTON
  快速配置按键
- CAN通信模块
- W25Q32flash外部存储器
- MCU内部要做上拉
sheet 2
- 防反接，过压保护，过流保护，缓启动
- 24V-12V
- 24V-5V
- 5V-3.3V
sheet 3
- MOS逆变桥&采样电路
- MOS桥驱动电路
- 10Ω电阻用于抑制振铃现象
- 此处的6pf电容主要是为了消除差模干扰
  可根据实际情况做调节
- 基准电压
- 运放的输出端带有低通滤波器，截止频率为795Hz，
  采用7极对的无刷电机时，
  转速达到6K时，电机电流频率为700Hz，
  能顺利通过滤波器，
  可根据自己的需求自行调节滤波器参数
